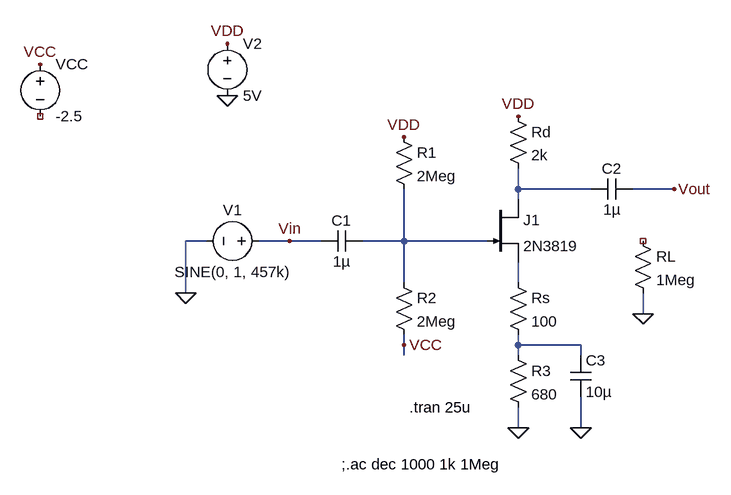
[diagram p0: schematic Biased_NType_JFET_Discrete_Amplifier_Design.asc]
Biased_NType_JFET_Discrete_Amplifier_Design.asc, the LTspice schematic file:
Version 4
SHEET 1 880 728
WIRE 464 288 464 256
WIRE 576 288 464 288
WIRE 704 288 640 288
WIRE 464 304 464 288
WIRE -16 368 -48 368
WIRE 112 368 64 368
WIRE 160 368 112 368
WIRE 288 368 288 288
WIRE 288 368 224 368
WIRE 416 368 288 368
WIRE 288 432 288 368
WIRE 464 432 464 400
WIRE -48 448 -48 368
WIRE 656 480 656 448
WIRE 288 528 288 512
WIRE 464 528 464 512
WIRE 560 528 464 528
WIRE 288 544 288 528
WIRE 464 544 464 528
WIRE 560 544 560 528
WIRE 464 656 464 624
WIRE 560 656 560 608
FLAG 656 480 0
FLAG -48 448 0
FLAG 16 144 0
FLAG 16 64 VDD
FLAG 464 176 VDD
FLAG 704 288 Vout
FLAG 112 368 Vin
FLAG 288 208 VDD
FLAG 464 656 0
FLAG 560 656 0
FLAG -272 96 VCC
FLAG 288 528 VCC
SYMBOL njf 416 304 R0
SYMATTR InstName J1
SYMATTR Value 2N3819
SYMBOL Res 272 416 R0
SYMATTR InstName R2
SYMATTR Value 2Meg
SYMBOL Res 448 416 R0
SYMATTR InstName Rs
SYMATTR Value 100
SYMBOL Res 448 160 R0
SYMATTR InstName Rd
SYMATTR Value 2k
SYMBOL Cap 224 352 R90
WINDOW 0 0 32 VBottom 2
WINDOW 3 32 32 VTop 2
SYMATTR InstName C1
SYMATTR Value 1µ
SYMBOL Cap 640 272 R90
WINDOW 0 0 32 VBottom 2
WINDOW 3 32 32 VTop 2
SYMATTR InstName C2
SYMATTR Value 1µ
SYMBOL Res 640 352 R0
SYMATTR InstName RL
SYMATTR Value 1Meg
SYMBOL Voltage 80 368 R90
WINDOW 0 -32 56 VBottom 2
WINDOW 3 32 56 VTop 2
SYMATTR InstName V1
SYMATTR Value SINE(0, 1, 457k)
SYMBOL Voltage 16 48 R0
SYMATTR InstName V2
SYMATTR Value 5V
SYMBOL Cap 544 544 R0
SYMATTR InstName C3
SYMATTR Value 10µ
SYMBOL Res 272 192 R0
SYMATTR InstName R1
SYMATTR Value 2Meg
SYMBOL Res 448 528 R0
SYMATTR InstName R3
SYMATTR Value 680
SYMBOL Voltage -272 80 R0
SYMATTR InstName VCC
SYMATTR Value -2.5
TEXT 296 624 Left 2 !.tran 25u
TEXT 192 712 Left 2 !;.ac dec 1000 1k 1Meg

The netlist it stands for:
* Biased_NType_JFET_Discrete_Amplifier_Design.asc
J1 N001 N002 N003 2N3819
R2 N002 VCC 2Meg
Rs N003 N004 100
Rd VDD N001 2k
C1 N002 Vin 1µ
C2 Vout N001 1µ
RL NC_01 0 1Meg
V1 Vin 0 SINE(0, 1, 457k)
V2 VDD 0 5V
C3 N004 0 10µ
R1 VDD N002 2Meg
R3 N004 0 680
VCC VCC NC_02 -2.5
.model NJF NJF
.model PJF PJF
.lib standard.jft
.tran 25u
;.ac dec 1000 1k 1Meg
.backanno
.end